# Altium schematic sheet TipWiring.SchDoc
size A
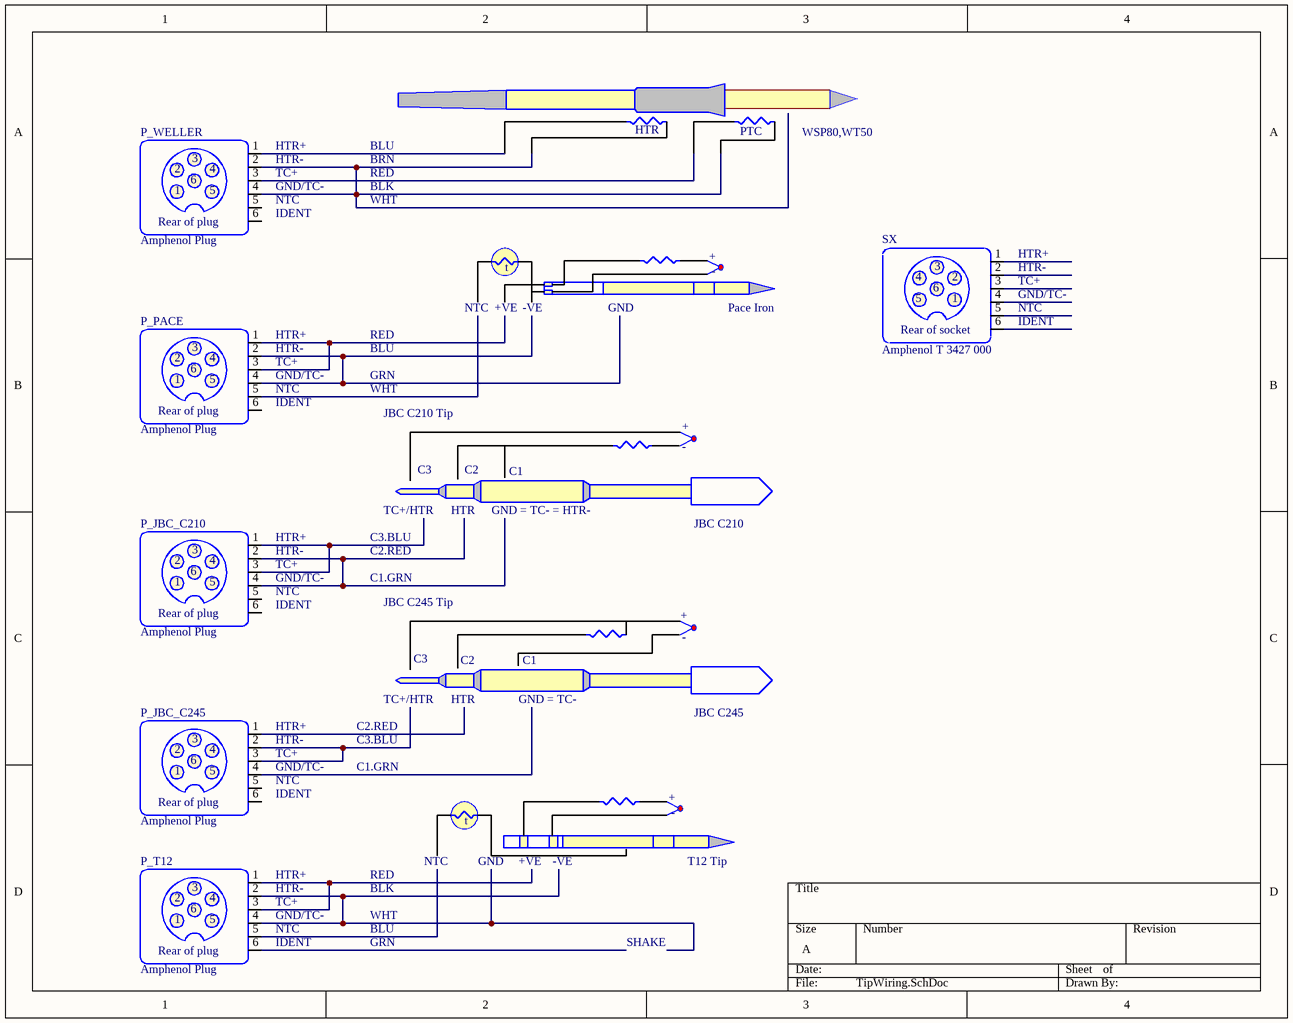
[diagram p0: TipWiring.SchDoc]

## Parts
JBC_C210_Tip  JBC C210  (mechanical)
JBC_C245_Tip  JBC C245  (mechanical)
P_JBC_C210  Amphenol Plug  (mechanical)
P_JBC_C245  Amphenol Plug  (mechanical)
P_PACE  Amphenol Plug  (mechanical)
P_T12  Amphenol Plug  (mechanical)
P_WELLER  Amphenol Plug  (mechanical)
Pace_Iron  Pace  (value not drawn)  (mechanical)
SX  Amphenol T 3427 000  (mechanical)
T12_Tip  T12 Tip  (value not drawn)  (mechanical)
WSP80,WT50  WELLER WSP80  (value not drawn)  (mechanical)

## Nets
NetP_JBC_C210_1: P_JBC_C210.1 P_JBC_C210.3
NetP_JBC_C210_2: P_JBC_C210.2 P_JBC_C210.4
NetP_JBC_C245_2: P_JBC_C245.2 P_JBC_C245.3
NetP_PACE_1: P_PACE.1 P_PACE.3
NetP_PACE_2: P_PACE.2 P_PACE.4
NetP_T12_1: P_T12.1 P_T12.3
NetP_T12_2: P_T12.2 P_T12.4
NetP_WELLER_2: P_WELLER.2 P_WELLER.4

Not connected (* = marked no-connect by the designer): P_JBC_C210 5 6; P_JBC_C245 1 4 5 6; P_PACE 5 6; P_T12 5 6; P_WELLER 1 3 5 6; SX 1 2 3 4 5 6

## Notes on the sheet
- (near P_WELLER) HTR-
- (near P_WELLER) HTR+
- BLU
- BRN
- (near P_WELLER) TC+
- (near P_WELLER) GND/TC-
- (near P_WELLER) NTC
- (near P_WELLER) IDENT
- RED
- WHT
- BLK
- (near SX) HTR-
- (near SX) HTR+
- (near SX) TC+
- (near SX) GND/TC-
- (near P_PACE) HTR-
- (near P_PACE) HTR+
- (near P_PACE) TC+
- (near SX) NTC
- (near SX) IDENT
- (near P_PACE) GND/TC-
- (near P_PACE) NTC
- (near P_PACE) IDENT
- GRN
- (near P_JBC_C210) HTR-
- (near P_JBC_C210) HTR+
- (near P_JBC_C210) TC+
- C2.RED
- C3.BLU
- (near P_JBC_C210) GND/TC-
- (near P_JBC_C210) NTC
- (near P_JBC_C210) IDENT
- C1.GRN
- (near P_JBC_C245) HTR-
- (near P_JBC_C245) HTR+
- (near P_JBC_C245) TC+
- (near P_JBC_C245) GND/TC-
- (near P_JBC_C245) NTC
- (near P_JBC_C245) IDENT
- (near P_T12) HTR-
- (near P_T12) HTR+
- (near P_T12) TC+
- (near P_T12) GND/TC-
- (near P_T12) NTC
- (near P_T12) IDENT
- SHAKE
- (in symbol Amphenol Plug) Rear of plug
- (in symbol Amphenol T 3427 000) Rear of socket
- (in symbol JBC C210) +; -; C3; C2; C1; TC+/HTR; HTR; GND = TC- = HTR-
- (in symbol JBC C245) +; -; C3; C2; C1; TC+/HTR; HTR; GND = TC-
- (in symbol Pace) +; t; -; NTC; +VE; -VE; GND
- (in symbol T12 Tip) +; -; t; NTC; GND; +VE; -VE
- (in symbol WELLER WSP80) HTR; PTC

## Library data of the parts
P_JBC_C210 P_JBC_C245 P_PACE P_T12 P_WELLER = Amphenol Plug: Circular Connector, C091B Series, Panel Mount Receptacle, 6 Contacts, Solder Socket, Metal Body
SX = Amphenol T 3427 000: Circular Connector, C091B Series, Panel Mount Receptacle, 6 Contacts, Solder Socket, Metal Body